# Altium project ay-arm-top.PRJPCB
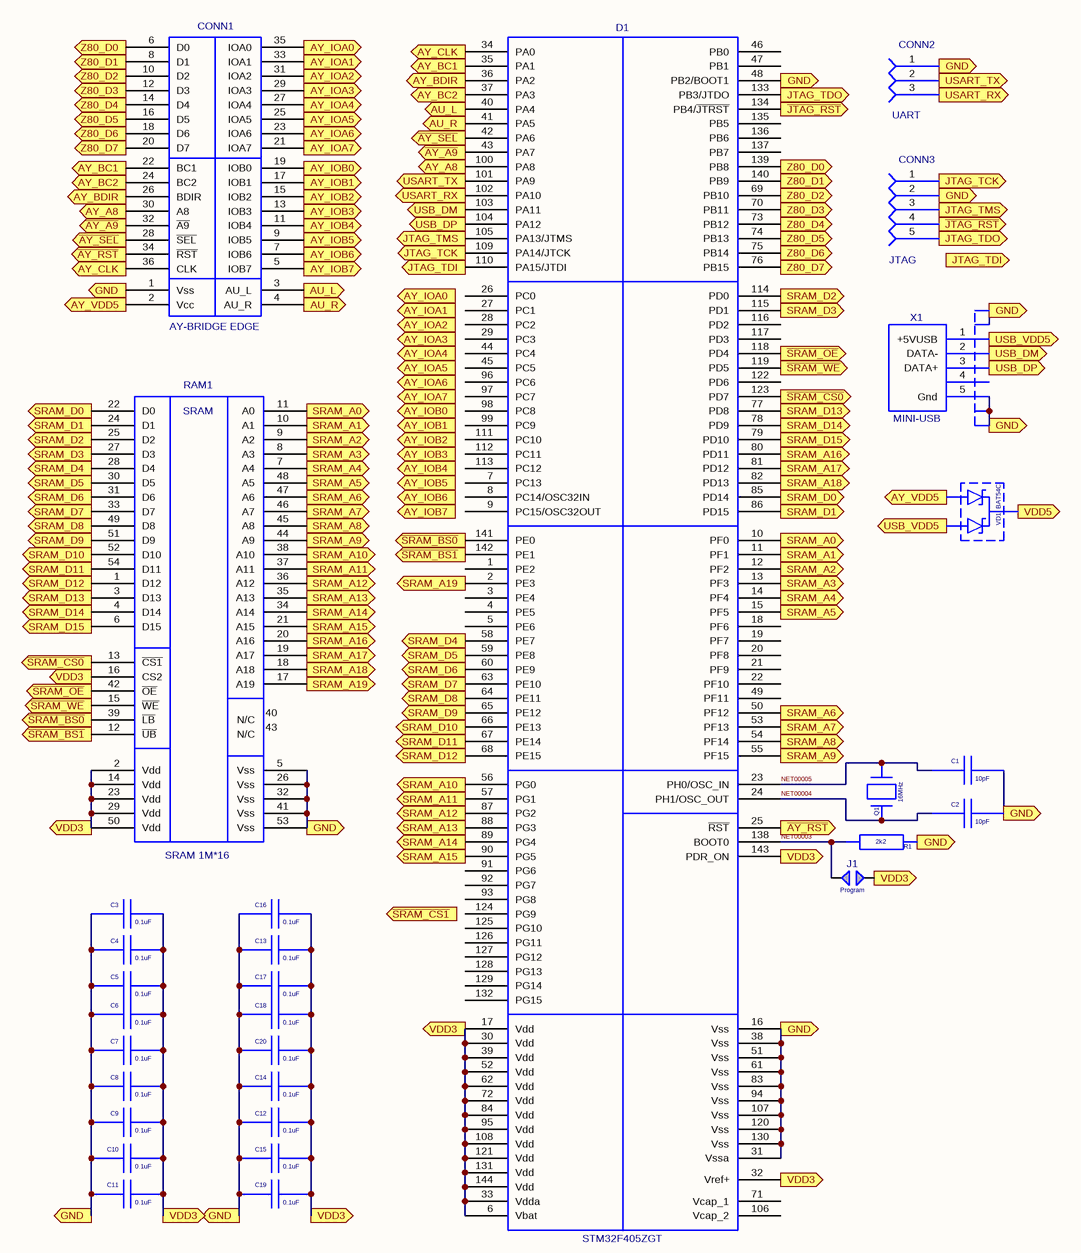
[diagram p0: Sheet1.SCHDOC]
1 sheet, 30 parts. Net scope: global (net labels, ports and power ports of the same name join across sheets).

## Sheet Sheet1.SCHDOC
size 508 x 508 mm; SheetNumber: 1; SheetTotal: 1; DocumentName: Sheet1.SCHDOC

### Parts
C1  value 10pF  [C-CHIP_CAPCHIP()]  (hidden comment: CAPCHIP)
C2  value 10pF  [C-CHIP_CAPCHIP()]  (hidden comment: CAPCHIP)
C3  value 0.1uF  [C-CHIP_CAPCHIP()]  (hidden comment: CAPCHIP)
C4  value 0.1uF  [C-CHIP_CAPCHIP()]  (hidden comment: CAPCHIP)
C5  value 0.1uF  [C-CHIP_CAPCHIP()]  (hidden comment: CAPCHIP)
C6  value 0.1uF  [C-CHIP_CAPCHIP()]  (hidden comment: CAPCHIP)
C7  value 0.1uF  [C-CHIP_CAPCHIP()]  (hidden comment: CAPCHIP)
C8  value 0.1uF  [C-CHIP_CAPCHIP()]  (hidden comment: CAPCHIP)
C9  value 0.1uF  [C-CHIP_CAPCHIP()]  (hidden comment: CAPCHIP)
C10  value 0.1uF  [C-CHIP_CAPCHIP()]  (hidden comment: CAPCHIP)
C11  value 0.1uF  [C-CHIP_CAPCHIP()]  (hidden comment: CAPCHIP)
C12  value 0.1uF  [C-CHIP_CAPCHIP()]  (hidden comment: CAPCHIP)
C13  value 0.1uF  [C-CHIP_CAPCHIP()]  (hidden comment: CAPCHIP)
C14  value 0.1uF  [C-CHIP_CAPCHIP()]  (hidden comment: CAPCHIP)
C15  value 0.1uF  [C-CHIP_CAPCHIP()]  (hidden comment: CAPCHIP)
C16  value 0.1uF  [C-CHIP_CAPCHIP()]  (hidden comment: CAPCHIP)
C17  value 0.1uF  [C-CHIP_CAPCHIP()]  (hidden comment: CAPCHIP)
C18  value 0.1uF  [C-CHIP_CAPCHIP()]  (hidden comment: CAPCHIP)
C19  value 0.1uF  [C-CHIP_CAPCHIP()]  (hidden comment: CAPCHIP)
C20  value 0.1uF  [C-CHIP_CAPCHIP()]  (hidden comment: CAPCHIP)
CONN1  AY-BRIDGE EDGE  [EDGE_SHORT_2X18_AY-BRIDGE EDGE()]
CONN2  value UART  [DIP-HEAD-3_DIP-HDR-3()]  (hidden comment: DIP-HDR-3)
CONN3  value JTAG  [DIP-HEAD-5_DIP-HDR-5()]  (hidden comment: DIP-HDR-5)
D1  STM32F405ZGT  [QFP20X20-144_STM32F405ZGT()]
J1  JUMPER  [JUMPER_JUMPER()]  (value not drawn)
Q1  value 16MHz  [CRYSTAL_CRYSTAL()]  (hidden comment: CRYSTAL)
R1  value 2k2  [R-CHIP_RESCHIP()]  (hidden comment: RESCHIP)
RAM1  SRAM 1M*16  [TSOP2_54_SRAM 1M*16()]
VD1  BAT54C  [SOT-23_BAT54C()]
X1  MINI-USB  [MINI-USB_MINI-USB()]

### Ports
AU_L (out), AU_R (out), AY_A8 (out), AY_BC1 (out), AY_BC2 (out), AY_BDIR (out), AY_CLK (out), AY_IOA0 (out), AY_IOA1 (out), AY_IOA2 (out), AY_IOA3 (out), AY_IOA4 (out), AY_IOA5 (out), AY_IOA6 (out), AY_IOA7 (out), AY_IOB0 (out), AY_IOB1 (out), AY_IOB2 (out), AY_IOB3 (out), AY_IOB4 (out), AY_IOB5 (out), AY_IOB6 (out), AY_IOB7 (out), AY_VDD5 (out), GND (out), JTAG_TCK (out), JTAG_TDI (out), JTAG_TDO (out), JTAG_TMS (out), SRAM_A0 (out), SRAM_A1 (out), SRAM_A2 (out), SRAM_A3 (out), SRAM_A4 (out), SRAM_A5 (out), SRAM_A6 (out), SRAM_A7 (out), SRAM_A8 (out), SRAM_A9 (out), SRAM_A10 (out), SRAM_A11 (out), SRAM_A12 (out), SRAM_A13 (out), SRAM_A14 (out), SRAM_A15 (out), SRAM_A16 (out), SRAM_A17 (out), SRAM_A18 (out), SRAM_A19 (out), SRAM_D0 (out), SRAM_D1 (out), SRAM_D2 (out), SRAM_D3 (out), SRAM_D4 (out), SRAM_D5 (out), SRAM_D6 (out), SRAM_D7 (out), SRAM_D8 (out), SRAM_D9 (out), SRAM_D10 (out), SRAM_D11 (out), SRAM_D12 (out), SRAM_D13 (out), SRAM_D14 (out), SRAM_D15 (out), USART_RX (out), USART_TX (out), USB_DM (out), USB_DP (out), USB_VDD5 (out), VDD3 (out), VDD5 (out), Z80_D0 (out), Z80_D1 (out), Z80_D2 (out), Z80_D3 (out), Z80_D4 (out), Z80_D5 (out), Z80_D6 (out), Z80_D7 (out), ~{AY_A9} (out), ~{AY_RST} (out), ~{AY_SEL} (out), ~{JTAG_RST} (out), ~{SRAM_BS0} (out), ~{SRAM_BS1} (out), ~{SRAM_CS0} (out), ~{SRAM_CS1} (out), ~{SRAM_OE} (out), ~{SRAM_WE} (out)

### Nets
~{AY_A9}: CONN1.32(~{A9}) D1.43(PA7) ; port ~{AY_A9}
~{AY_RST}: CONN1.34(~{RST}) D1.25(~{RST}) ; port ~{AY_RST}
~{AY_SEL}: CONN1.28(~{SEL}) D1.42(PA6) ; port ~{AY_SEL}
AU_L: CONN1.3(AU_L) D1.40(PA4) ; port AU_L
AU_R: CONN1.4(AU_R) D1.41(PA5) ; port AU_R
AY_A8: CONN1.30(A8) D1.100(PA8) ; port AY_A8
AY_BC1: CONN1.22(BC1) D1.35(PA1) ; port AY_BC1
AY_BC2: CONN1.24(BC2) D1.37(PA3) ; port AY_BC2
AY_BDIR: CONN1.26(BDIR) D1.36(PA2) ; port AY_BDIR
AY_CLK: CONN1.36(CLK) D1.34(PA0) ; port AY_CLK
AY_IOA0: CONN1.35(IOA0) ; port AY_IOA0
AY_IOA1: CONN1.33(IOA1) ; port AY_IOA1
AY_IOA2: CONN1.31(IOA2) ; port AY_IOA2
AY_IOA3: CONN1.29(IOA3) ; port AY_IOA3
AY_IOA4: CONN1.27(IOA4) ; port AY_IOA4
AY_IOA5: CONN1.25(IOA5) ; port AY_IOA5
AY_IOA6: CONN1.23(IOA6) ; port AY_IOA6
AY_IOA7: CONN1.21(IOA7) ; port AY_IOA7
AY_IOB0: CONN1.19(IOB0) ; port AY_IOB0
AY_IOB1: CONN1.17(IOB1) ; port AY_IOB1
AY_IOB2: CONN1.15(IOB2) ; port AY_IOB2
AY_IOB3: CONN1.13(IOB3) ; port AY_IOB3
AY_IOB4: CONN1.11(IOB4) ; port AY_IOB4
AY_IOB5: CONN1.9(IOB5) ; port AY_IOB5
AY_IOB6: CONN1.7(IOB6) ; port AY_IOB6
AY_IOB7: CONN1.5(IOB7) ; port AY_IOB7
AY_VDD5: CONN1.2(Vcc) VD1.1 ; port AY_VDD5
GND: C1.2 C2.2 C3.1 C4.1 C5.1 C6.1 C7.1 C8.1 C9.1 C10.1 C11.1 C12.1 C13.1 C14.1 C15.1 C16.1 C17.1 C18.1 C19.1 C20.1 CONN1.1(Vss) CONN2.1 CONN3.2 D1.16(Vss) D1.31(Vssa) D1.38(Vss) D1.48(PB2/BOOT1) D1.51(Vss) D1.61(Vss) D1.83(Vss) D1.94(Vss) D1.107(Vss) D1.120(Vss) D1.130(Vss) R1.2(i/o1) RAM1.5(Vss) RAM1.26(Vss) RAM1.32(Vss) RAM1.41(Vss) RAM1.53(Vss) X1.5(Gnd) X1.6 X1.7 X1.8 X1.9 ; port GND
~{JTAG_RST}: CONN3.4 D1.134(PB4/~{JTRST}) ; port ~{JTAG_RST}
JTAG_TCK: CONN3.1 D1.109(PA14/JTCK) ; port JTAG_TCK
JTAG_TDI: D1.110(PA15/JTDI) ; port JTAG_TDI
JTAG_TDO: CONN3.5 D1.133(PB3/JTDO) ; port JTAG_TDO
JTAG_TMS: CONN3.3 D1.105(PA13/JTMS) ; port JTAG_TMS
NET00003: D1.138(BOOT0) J1.0 R1.1(i/o)
NET00004: C2.1 D1.24(PH1/OSC_OUT) Q1.A
NET00005: C1.1 D1.23(PH0/OSC_IN) Q1.B
~{SRAM_BS0}: D1.141(PE0) RAM1.39(~{LB}) ; port ~{SRAM_BS0}
~{SRAM_BS1}: D1.142(PE1) RAM1.12(~{UB}) ; port ~{SRAM_BS1}
~{SRAM_CS0}: D1.123(PD7) RAM1.13(~{CS1}) ; port ~{SRAM_CS0}
~{SRAM_OE}: D1.118(PD4) RAM1.42(~{OE}) ; port ~{SRAM_OE}
~{SRAM_WE}: D1.119(PD5) RAM1.15(~{WE}) ; port ~{SRAM_WE}
SRAM_A0: D1.10(PF0) RAM1.11(A0) ; port SRAM_A0
SRAM_A1: D1.11(PF1) RAM1.10(A1) ; port SRAM_A1
SRAM_A2: D1.12(PF2) RAM1.9(A2) ; port SRAM_A2
SRAM_A3: D1.13(PF3) RAM1.8(A3) ; port SRAM_A3
SRAM_A4: D1.14(PF4) RAM1.7(A4) ; port SRAM_A4
SRAM_A5: D1.15(PF5) RAM1.48(A5) ; port SRAM_A5
SRAM_A6: D1.50(PF12) RAM1.47(A6) ; port SRAM_A6
SRAM_A7: D1.53(PF13) RAM1.46(A7) ; port SRAM_A7
SRAM_A8: D1.54(PF14) RAM1.45(A8) ; port SRAM_A8
SRAM_A9: D1.55(PF15) RAM1.44(A9) ; port SRAM_A9
SRAM_A10: D1.56(PG0) RAM1.38(A10) ; port SRAM_A10
SRAM_A11: D1.57(PG1) RAM1.37(A11) ; port SRAM_A11
SRAM_A12: D1.87(PG2) RAM1.36(A12) ; port SRAM_A12
SRAM_A13: D1.88(PG3) RAM1.35(A13) ; port SRAM_A13
SRAM_A14: D1.89(PG4) RAM1.34(A14) ; port SRAM_A14
SRAM_A15: D1.90(PG5) RAM1.21(A15) ; port SRAM_A15
SRAM_A16: D1.80(PD11) RAM1.20(A16) ; port SRAM_A16
SRAM_A17: D1.81(PD12) RAM1.19(A17) ; port SRAM_A17
SRAM_A18: D1.82(PD13) RAM1.18(A18) ; port SRAM_A18
SRAM_A19: D1.2(PE3) RAM1.17(A19) ; port SRAM_A19
SRAM_D0: D1.85(PD14) RAM1.22(D0) ; port SRAM_D0
SRAM_D1: D1.86(PD15) RAM1.24(D1) ; port SRAM_D1
SRAM_D2: D1.114(PD0) RAM1.25(D2) ; port SRAM_D2
SRAM_D3: D1.115(PD1) RAM1.27(D3) ; port SRAM_D3
SRAM_D4: D1.58(PE7) RAM1.28(D4) ; port SRAM_D4
SRAM_D5: D1.59(PE8) RAM1.30(D5) ; port SRAM_D5
SRAM_D6: D1.60(PE9) RAM1.31(D6) ; port SRAM_D6
SRAM_D7: D1.63(PE10) RAM1.33(D7) ; port SRAM_D7
SRAM_D8: D1.64(PE11) RAM1.49(D8) ; port SRAM_D8
SRAM_D9: D1.65(PE12) RAM1.51(D9) ; port SRAM_D9
SRAM_D10: D1.66(PE13) RAM1.52(D10) ; port SRAM_D10
SRAM_D11: D1.67(PE14) RAM1.54(D11) ; port SRAM_D11
SRAM_D12: D1.68(PE15) RAM1.1(D12) ; port SRAM_D12
SRAM_D13: D1.77(PD8) RAM1.3(D13) ; port SRAM_D13
SRAM_D14: D1.78(PD9) RAM1.4(D14) ; port SRAM_D14
SRAM_D15: D1.79(PD10) RAM1.6(D15) ; port SRAM_D15
USART_RX: CONN2.3 D1.102(PA10) ; port USART_RX
USART_TX: CONN2.2 D1.101(PA9) ; port USART_TX
USB_DM: D1.103(PA11) X1.2(DATA-) ; port USB_DM
USB_DP: D1.104(PA12) X1.3(DATA+) ; port USB_DP
USB_VDD5: VD1.2 X1.1(+5VUSB) ; port USB_VDD5
VDD3: C3.2 C4.2 C5.2 C6.2 C7.2 C8.2 C9.2 C10.2 C11.2 C12.2 C13.2 C14.2 C15.2 C16.2 C17.2 C18.2 C19.2 C20.2 D1.6(Vbat) D1.17(Vdd) D1.30(Vdd) D1.32(Vref+) D1.33(Vdda) D1.39(Vdd) D1.52(Vdd) D1.62(Vdd) D1.72(Vdd) D1.84(Vdd) D1.95(Vdd) D1.108(Vdd) D1.121(Vdd) D1.131(Vdd) D1.143(PDR_ON) D1.144(Vdd) J1.1 RAM1.2(Vdd) RAM1.14(Vdd) RAM1.16(CS2) RAM1.23(Vdd) RAM1.29(Vdd) RAM1.50(Vdd) ; port VDD3
VDD5: VD1.3 ; port VDD5
Z80_D0: CONN1.6(D0) D1.139(PB8) ; port Z80_D0
Z80_D1: CONN1.8(D1) D1.140(PB9) ; port Z80_D1
Z80_D2: CONN1.10(D2) D1.69(PB10) ; port Z80_D2
Z80_D3: CONN1.12(D3) D1.70(PB11) ; port Z80_D3
Z80_D4: CONN1.14(D4) D1.73(PB12) ; port Z80_D4
Z80_D5: CONN1.16(D5) D1.74(PB13) ; port Z80_D5
Z80_D6: CONN1.18(D6) D1.75(PB14) ; port Z80_D6
Z80_D7: CONN1.20(D7) D1.76(PB15) ; port Z80_D7

Not connected (* = marked no-connect by the designer): D1 1(PE2) 3(PE4) 4(PE5) 5(PE6) 7(PC13) 8(PC14/OSC32IN) 9(PC15/OSC32OUT) 18(PF6) 19(PF7) 20(PF8) 21(PF9) 22(PF10) 26(PC0) 27(PC1) 28(PC2) 29(PC3) 44(PC4) 45(PC5) 46(PB0) 47(PB1) 49(PF11) 71(Vcap_1) 91(PG6) 92(PG7) 93(PG8) 96(PC6) 97(PC7) 98(PC8) 99(PC9) 106(Vcap_2) 111(PC10) 112(PC11) 113(PC12) 116(PD2) 117(PD3) 122(PD6) 124(PG9) 125(PG10) 126(PG11) 127(PG12) 128(PG13) 129(PG14) 132(PG15) 135(PB5) 136(PB6) 137(PB7); RAM1 40(N/C) 43(N/C); X1 4

### Notes on the sheet
- (in symbol SRAM 1M*16) SRAM

### Library data of the parts
J1 = JUMPER: Program
CONN1 = AY-BRIDGE EDGE: Value: *
D1 = STM32F405ZGT: Value: *
Q1 = CRYSTAL: Description: Crystal
RAM1 = SRAM 1M*16: Value: *
VD1 = BAT54C: Value: *
X1 = MINI-USB: Value: *